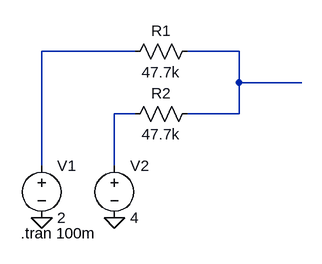
[diagram p0: schematic Сумматор_DC.asc]
Сумматор_DC.asc, the LTspice schematic file:
Version 4
SHEET 1 880 680
WIRE 208 16 64 16
WIRE 368 16 288 16
WIRE 368 64 368 16
WIRE 464 64 368 64
WIRE 208 112 176 112
WIRE 368 112 368 64
WIRE 368 112 288 112
WIRE 64 192 64 16
WIRE 176 192 176 112
FLAG 64 272 0
FLAG 176 272 0
SYMBOL voltage 64 176 R0
WINDOW 123 0 0 Left 2
WINDOW 39 0 0 Left 2
SYMATTR InstName V1
SYMATTR Value 2
SYMBOL voltage 176 176 R0
WINDOW 123 0 0 Left 2
WINDOW 39 0 0 Left 2
SYMATTR InstName V2
SYMATTR Value 4
SYMBOL res 304 0 R90
WINDOW 0 0 56 VBottom 2
WINDOW 3 32 56 VTop 2
SYMATTR InstName R1
SYMATTR Value 47.7k
SYMBOL res 304 96 R90
WINDOW 0 0 56 VBottom 2
WINDOW 3 32 56 VTop 2
SYMATTR InstName R2
SYMATTR Value 47.7k
TEXT 32 296 Left 2 !.tran 100m

The netlist it stands for:
* Сумматор_DC.asc
V1 N001 0 2
V2 N003 0 4
R1 N002 N001 47.7k
R2 N002 N003 47.7k
.tran 100m
.backanno
.end